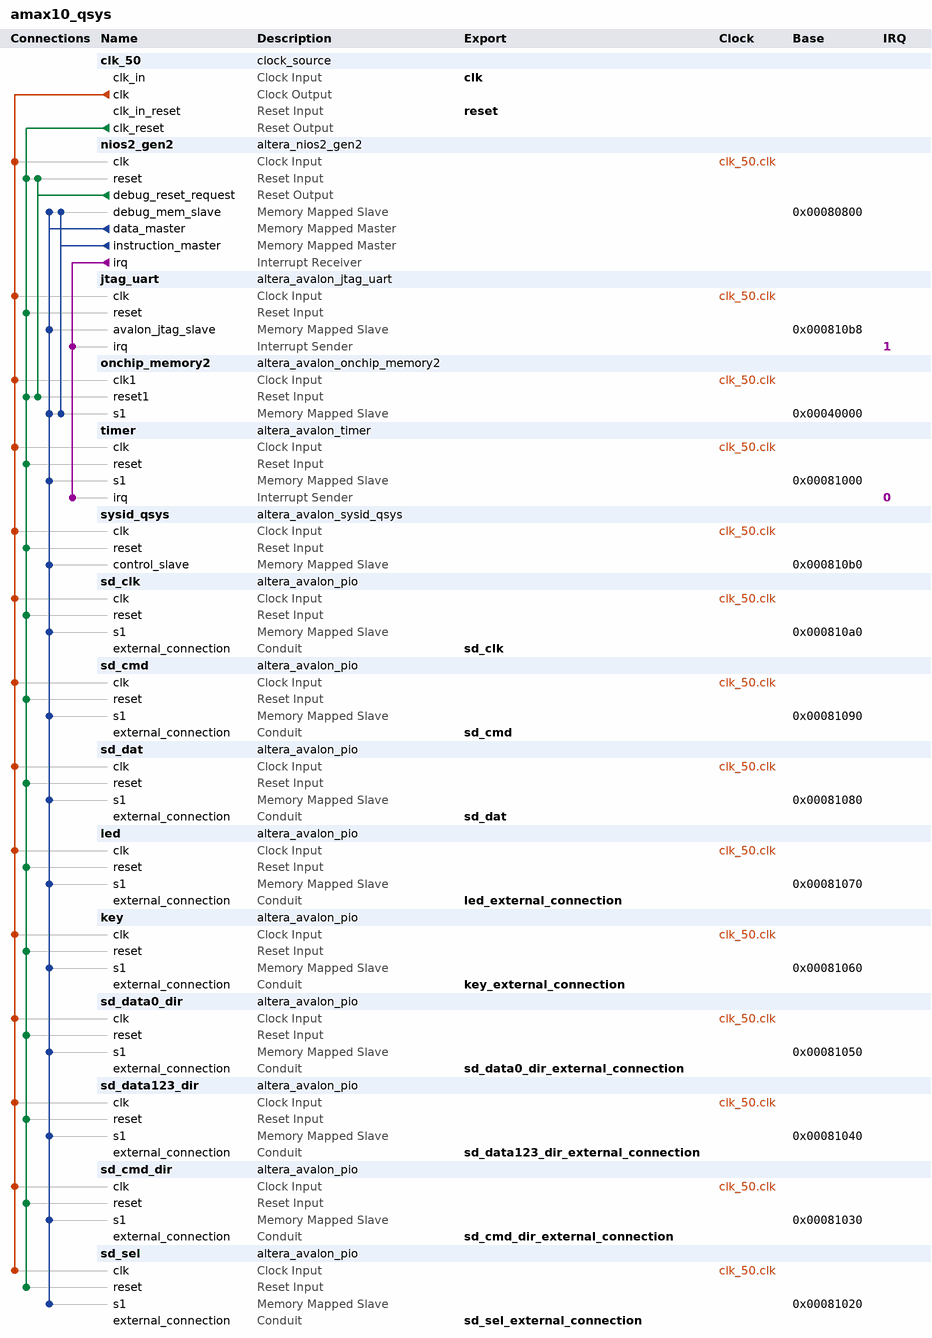
[diagram p0: system contents]
# Platform Designer (Qsys) system amax10_qsys, MAX 10 10M50DAF484C7G
# Parameters at their usual value, and those the tool derives, are not listed.
package require -exact qsys 15.0
create_system amax10_qsys
set_project_property DEVICE_FAMILY {MAX 10}
set_project_property DEVICE 10M50DAF484C7G

add_instance clk_50 clock_source 15.0
set_instance_parameter_value clk_50 clockFrequency 50000000

add_instance nios2_gen2 altera_nios2_gen2 15.0
set_instance_parameter_value nios2_gen2 dcache_size 2048
set_instance_parameter_value nios2_gen2 exceptionSlave onchip_memory2.s1
set_instance_parameter_value nios2_gen2 icache_size 4096
set_instance_parameter_value nios2_gen2 impl Tiny
set_instance_parameter_value nios2_gen2 resetSlave onchip_memory2.s1

add_instance jtag_uart altera_avalon_jtag_uart 15.0
set_instance_parameter_value jtag_uart simInteractiveOptions NO_INTERACTIVE_WINDOWS

add_instance onchip_memory2 altera_avalon_onchip_memory2 15.0
set_instance_parameter_value onchip_memory2 dataWidth 32
set_instance_parameter_value onchip_memory2 dualPort false
set_instance_parameter_value onchip_memory2 initMemContent false
set_instance_parameter_value onchip_memory2 initializationFileName onchip_mem.hex
set_instance_parameter_value onchip_memory2 memorySize 150000

add_instance timer altera_avalon_timer 15.0
set_instance_parameter_value timer period 1
set_instance_parameter_value timer periodUnits MSEC

add_instance sysid_qsys altera_avalon_sysid_qsys 15.0
set_instance_parameter_value sysid_qsys id 0

add_instance sd_clk altera_avalon_pio 15.0
set_instance_parameter_value sd_clk direction Output
set_instance_parameter_value sd_clk width 1

add_instance sd_cmd altera_avalon_pio 15.0
set_instance_parameter_value sd_cmd direction Bidir
set_instance_parameter_value sd_cmd width 1

add_instance sd_dat altera_avalon_pio 15.0
set_instance_parameter_value sd_dat direction Bidir
set_instance_parameter_value sd_dat width 4

add_instance led altera_avalon_pio 15.0
set_instance_parameter_value led direction Output
set_instance_parameter_value led width 8

add_instance key altera_avalon_pio 15.0
set_instance_parameter_value key direction Input
set_instance_parameter_value key width 2

add_instance sd_data0_dir altera_avalon_pio 15.0
set_instance_parameter_value sd_data0_dir direction Output
set_instance_parameter_value sd_data0_dir width 1

add_instance sd_data123_dir altera_avalon_pio 15.0
set_instance_parameter_value sd_data123_dir direction Output
set_instance_parameter_value sd_data123_dir width 1

add_instance sd_cmd_dir altera_avalon_pio 15.0
set_instance_parameter_value sd_cmd_dir direction Output
set_instance_parameter_value sd_cmd_dir width 1

add_instance sd_sel altera_avalon_pio 15.0
set_instance_parameter_value sd_sel direction Output
set_instance_parameter_value sd_sel width 1

# connections
add_connection clk_50.clk jtag_uart.clk clock
add_connection clk_50.clk key.clk clock
add_connection clk_50.clk led.clk clock
add_connection clk_50.clk nios2_gen2.clk clock
add_connection clk_50.clk onchip_memory2.clk1 clock
add_connection clk_50.clk sd_clk.clk clock
add_connection clk_50.clk sd_cmd.clk clock
add_connection clk_50.clk sd_cmd_dir.clk clock
add_connection clk_50.clk sd_dat.clk clock
add_connection clk_50.clk sd_data0_dir.clk clock
add_connection clk_50.clk sd_data123_dir.clk clock
add_connection clk_50.clk sd_sel.clk clock
add_connection clk_50.clk sysid_qsys.clk clock
add_connection clk_50.clk timer.clk clock
add_connection clk_50.clk_reset jtag_uart.reset reset
add_connection clk_50.clk_reset key.reset reset
add_connection clk_50.clk_reset led.reset reset
add_connection clk_50.clk_reset nios2_gen2.reset reset
add_connection clk_50.clk_reset onchip_memory2.reset1 reset
add_connection clk_50.clk_reset sd_clk.reset reset
add_connection clk_50.clk_reset sd_cmd.reset reset
add_connection clk_50.clk_reset sd_cmd_dir.reset reset
add_connection clk_50.clk_reset sd_dat.reset reset
add_connection clk_50.clk_reset sd_data0_dir.reset reset
add_connection clk_50.clk_reset sd_data123_dir.reset reset
add_connection clk_50.clk_reset sd_sel.reset reset
add_connection clk_50.clk_reset sysid_qsys.reset reset
add_connection clk_50.clk_reset timer.reset reset
add_connection nios2_gen2.debug_reset_request nios2_gen2.reset reset
add_connection nios2_gen2.debug_reset_request onchip_memory2.reset1 reset
add_connection nios2_gen2.data_master jtag_uart.avalon_jtag_slave avalon
set_connection_parameter_value nios2_gen2.data_master/jtag_uart.avalon_jtag_slave baseAddress 0x000810b8
add_connection nios2_gen2.data_master key.s1 avalon
set_connection_parameter_value nios2_gen2.data_master/key.s1 baseAddress 0x00081060
add_connection nios2_gen2.data_master led.s1 avalon
set_connection_parameter_value nios2_gen2.data_master/led.s1 baseAddress 0x00081070
add_connection nios2_gen2.data_master nios2_gen2.debug_mem_slave avalon
set_connection_parameter_value nios2_gen2.data_master/nios2_gen2.debug_mem_slave baseAddress 0x00080800
add_connection nios2_gen2.data_master onchip_memory2.s1 avalon
set_connection_parameter_value nios2_gen2.data_master/onchip_memory2.s1 baseAddress 0x00040000
add_connection nios2_gen2.data_master sd_clk.s1 avalon
set_connection_parameter_value nios2_gen2.data_master/sd_clk.s1 baseAddress 0x000810a0
add_connection nios2_gen2.data_master sd_cmd.s1 avalon
set_connection_parameter_value nios2_gen2.data_master/sd_cmd.s1 baseAddress 0x00081090
add_connection nios2_gen2.data_master sd_cmd_dir.s1 avalon
set_connection_parameter_value nios2_gen2.data_master/sd_cmd_dir.s1 baseAddress 0x00081030
add_connection nios2_gen2.data_master sd_dat.s1 avalon
set_connection_parameter_value nios2_gen2.data_master/sd_dat.s1 baseAddress 0x00081080
add_connection nios2_gen2.data_master sd_data0_dir.s1 avalon
set_connection_parameter_value nios2_gen2.data_master/sd_data0_dir.s1 baseAddress 0x00081050
add_connection nios2_gen2.data_master sd_data123_dir.s1 avalon
set_connection_parameter_value nios2_gen2.data_master/sd_data123_dir.s1 baseAddress 0x00081040
add_connection nios2_gen2.data_master sd_sel.s1 avalon
set_connection_parameter_value nios2_gen2.data_master/sd_sel.s1 baseAddress 0x00081020
add_connection nios2_gen2.data_master sysid_qsys.control_slave avalon
set_connection_parameter_value nios2_gen2.data_master/sysid_qsys.control_slave baseAddress 0x000810b0
add_connection nios2_gen2.data_master timer.s1 avalon
set_connection_parameter_value nios2_gen2.data_master/timer.s1 baseAddress 0x00081000
add_connection nios2_gen2.instruction_master nios2_gen2.debug_mem_slave avalon
set_connection_parameter_value nios2_gen2.instruction_master/nios2_gen2.debug_mem_slave baseAddress 0x00080800
add_connection nios2_gen2.instruction_master onchip_memory2.s1 avalon
set_connection_parameter_value nios2_gen2.instruction_master/onchip_memory2.s1 baseAddress 0x00040000
add_connection nios2_gen2.irq jtag_uart.irq interrupt
set_connection_parameter_value nios2_gen2.irq/jtag_uart.irq irqNumber 1
add_connection nios2_gen2.irq timer.irq interrupt
set_connection_parameter_value nios2_gen2.irq/timer.irq irqNumber 0

# exported interfaces
add_interface clk clock sink
set_interface_property clk EXPORT_OF clk_50.clk_in
add_interface key_external_connection conduit end
set_interface_property key_external_connection EXPORT_OF key.external_connection
add_interface led_external_connection conduit end
set_interface_property led_external_connection EXPORT_OF led.external_connection
add_interface reset reset sink
set_interface_property reset EXPORT_OF clk_50.clk_in_reset
add_interface sd_clk conduit end
set_interface_property sd_clk EXPORT_OF sd_clk.external_connection
add_interface sd_cmd conduit end
set_interface_property sd_cmd EXPORT_OF sd_cmd.external_connection
add_interface sd_cmd_dir_external_connection conduit end
set_interface_property sd_cmd_dir_external_connection EXPORT_OF sd_cmd_dir.external_connection
add_interface sd_dat conduit end
set_interface_property sd_dat EXPORT_OF sd_dat.external_connection
add_interface sd_data0_dir_external_connection conduit end
set_interface_property sd_data0_dir_external_connection EXPORT_OF sd_data0_dir.external_connection
add_interface sd_data123_dir_external_connection conduit end
set_interface_property sd_data123_dir_external_connection EXPORT_OF sd_data123_dir.external_connection
add_interface sd_sel_external_connection conduit end
set_interface_property sd_sel_external_connection EXPORT_OF sd_sel.external_connection

set_interconnect_requirement {$system} qsys_mm.clockCrossingAdapter HANDSHAKE
set_interconnect_requirement {$system} qsys_mm.insertDefaultSlave FALSE
set_interconnect_requirement {$system} qsys_mm.maxAdditionalLatency 1

save_system amax10_qsys.qsys
